# EAGLE design final (EAGLE 9.6.2)
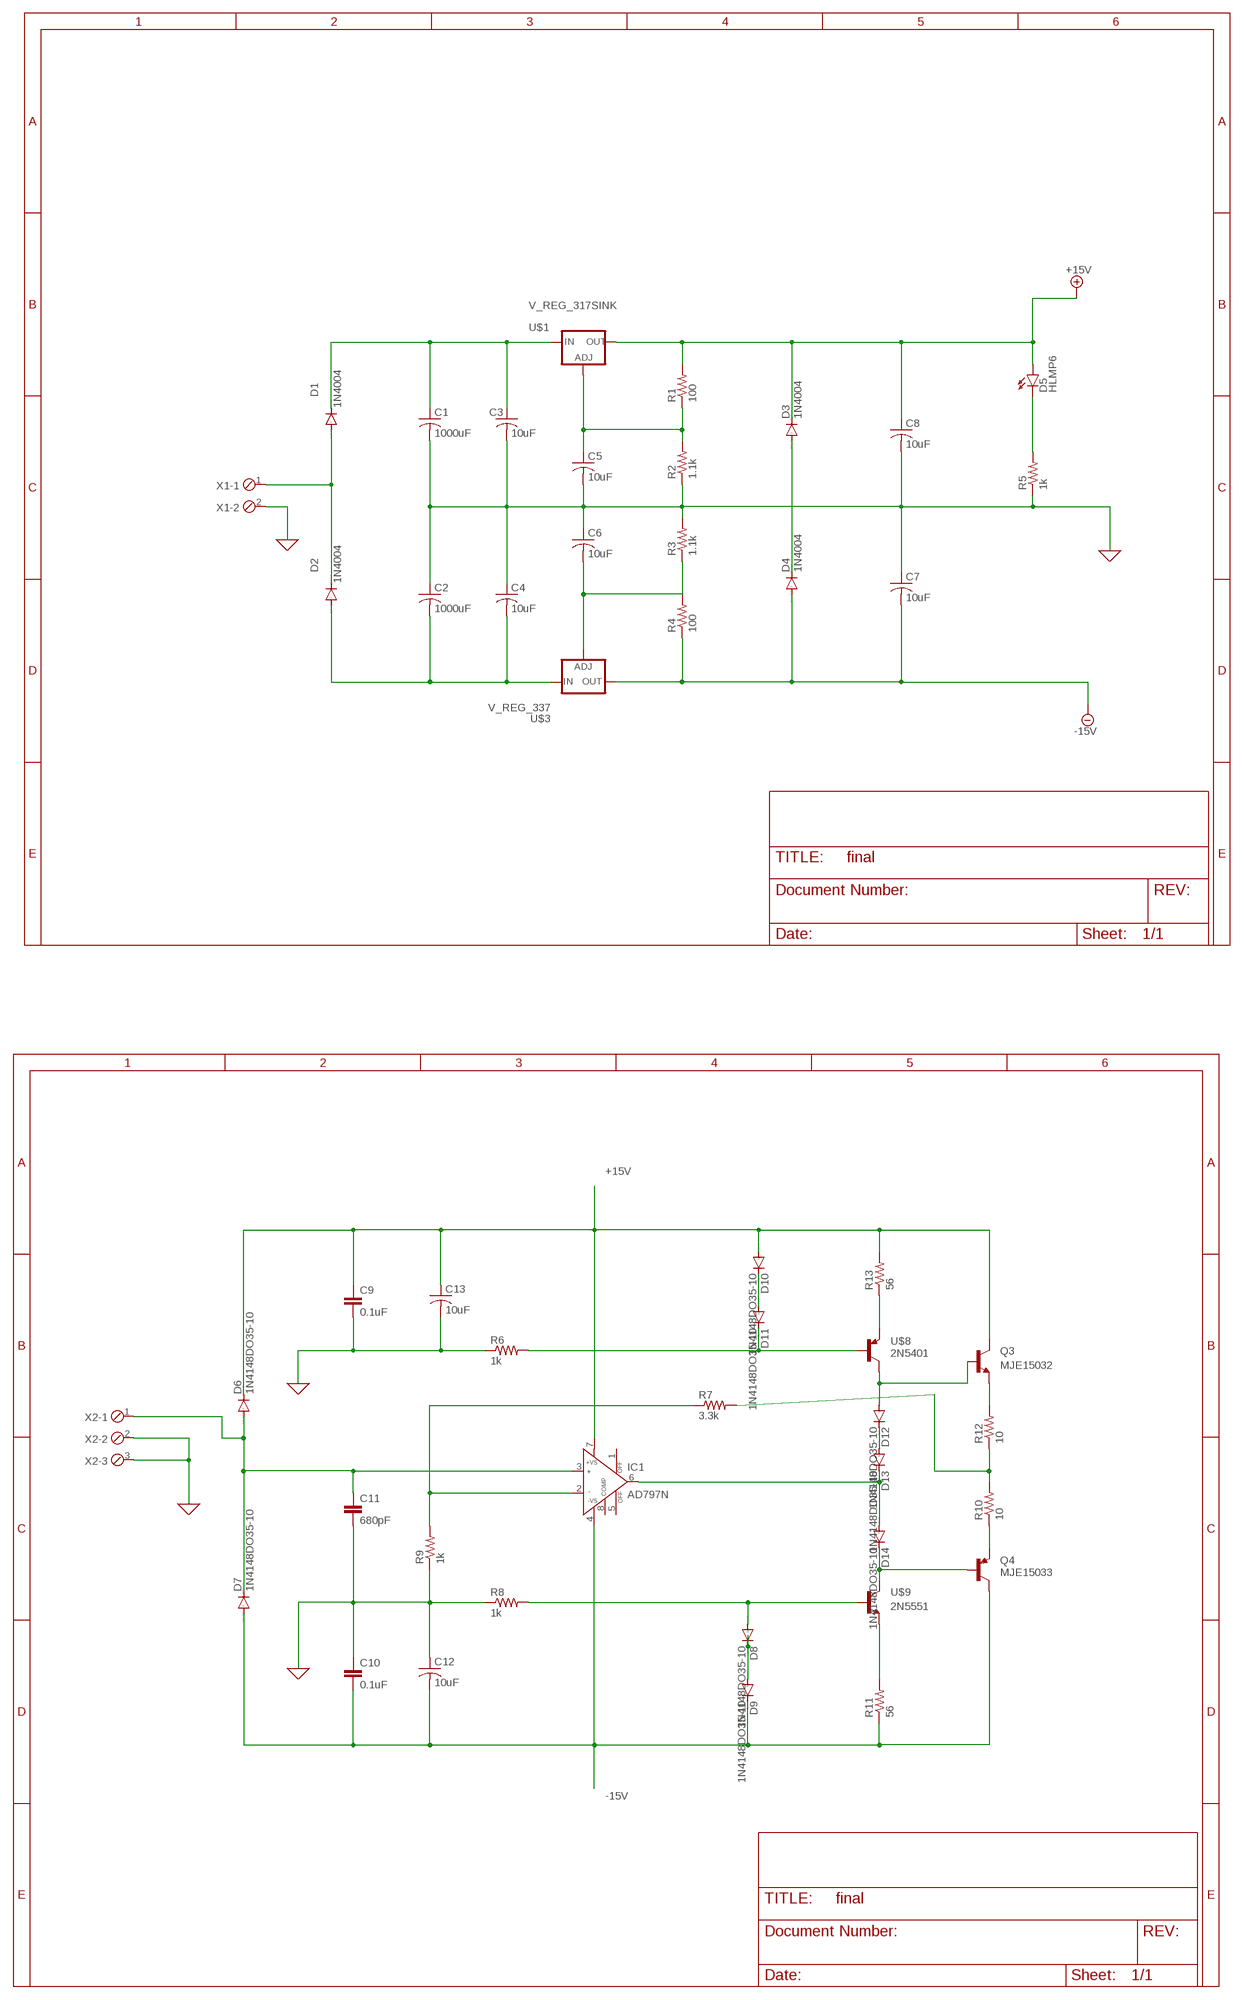
[diagram p0: schematic, sheet 1, part 1 of 2]
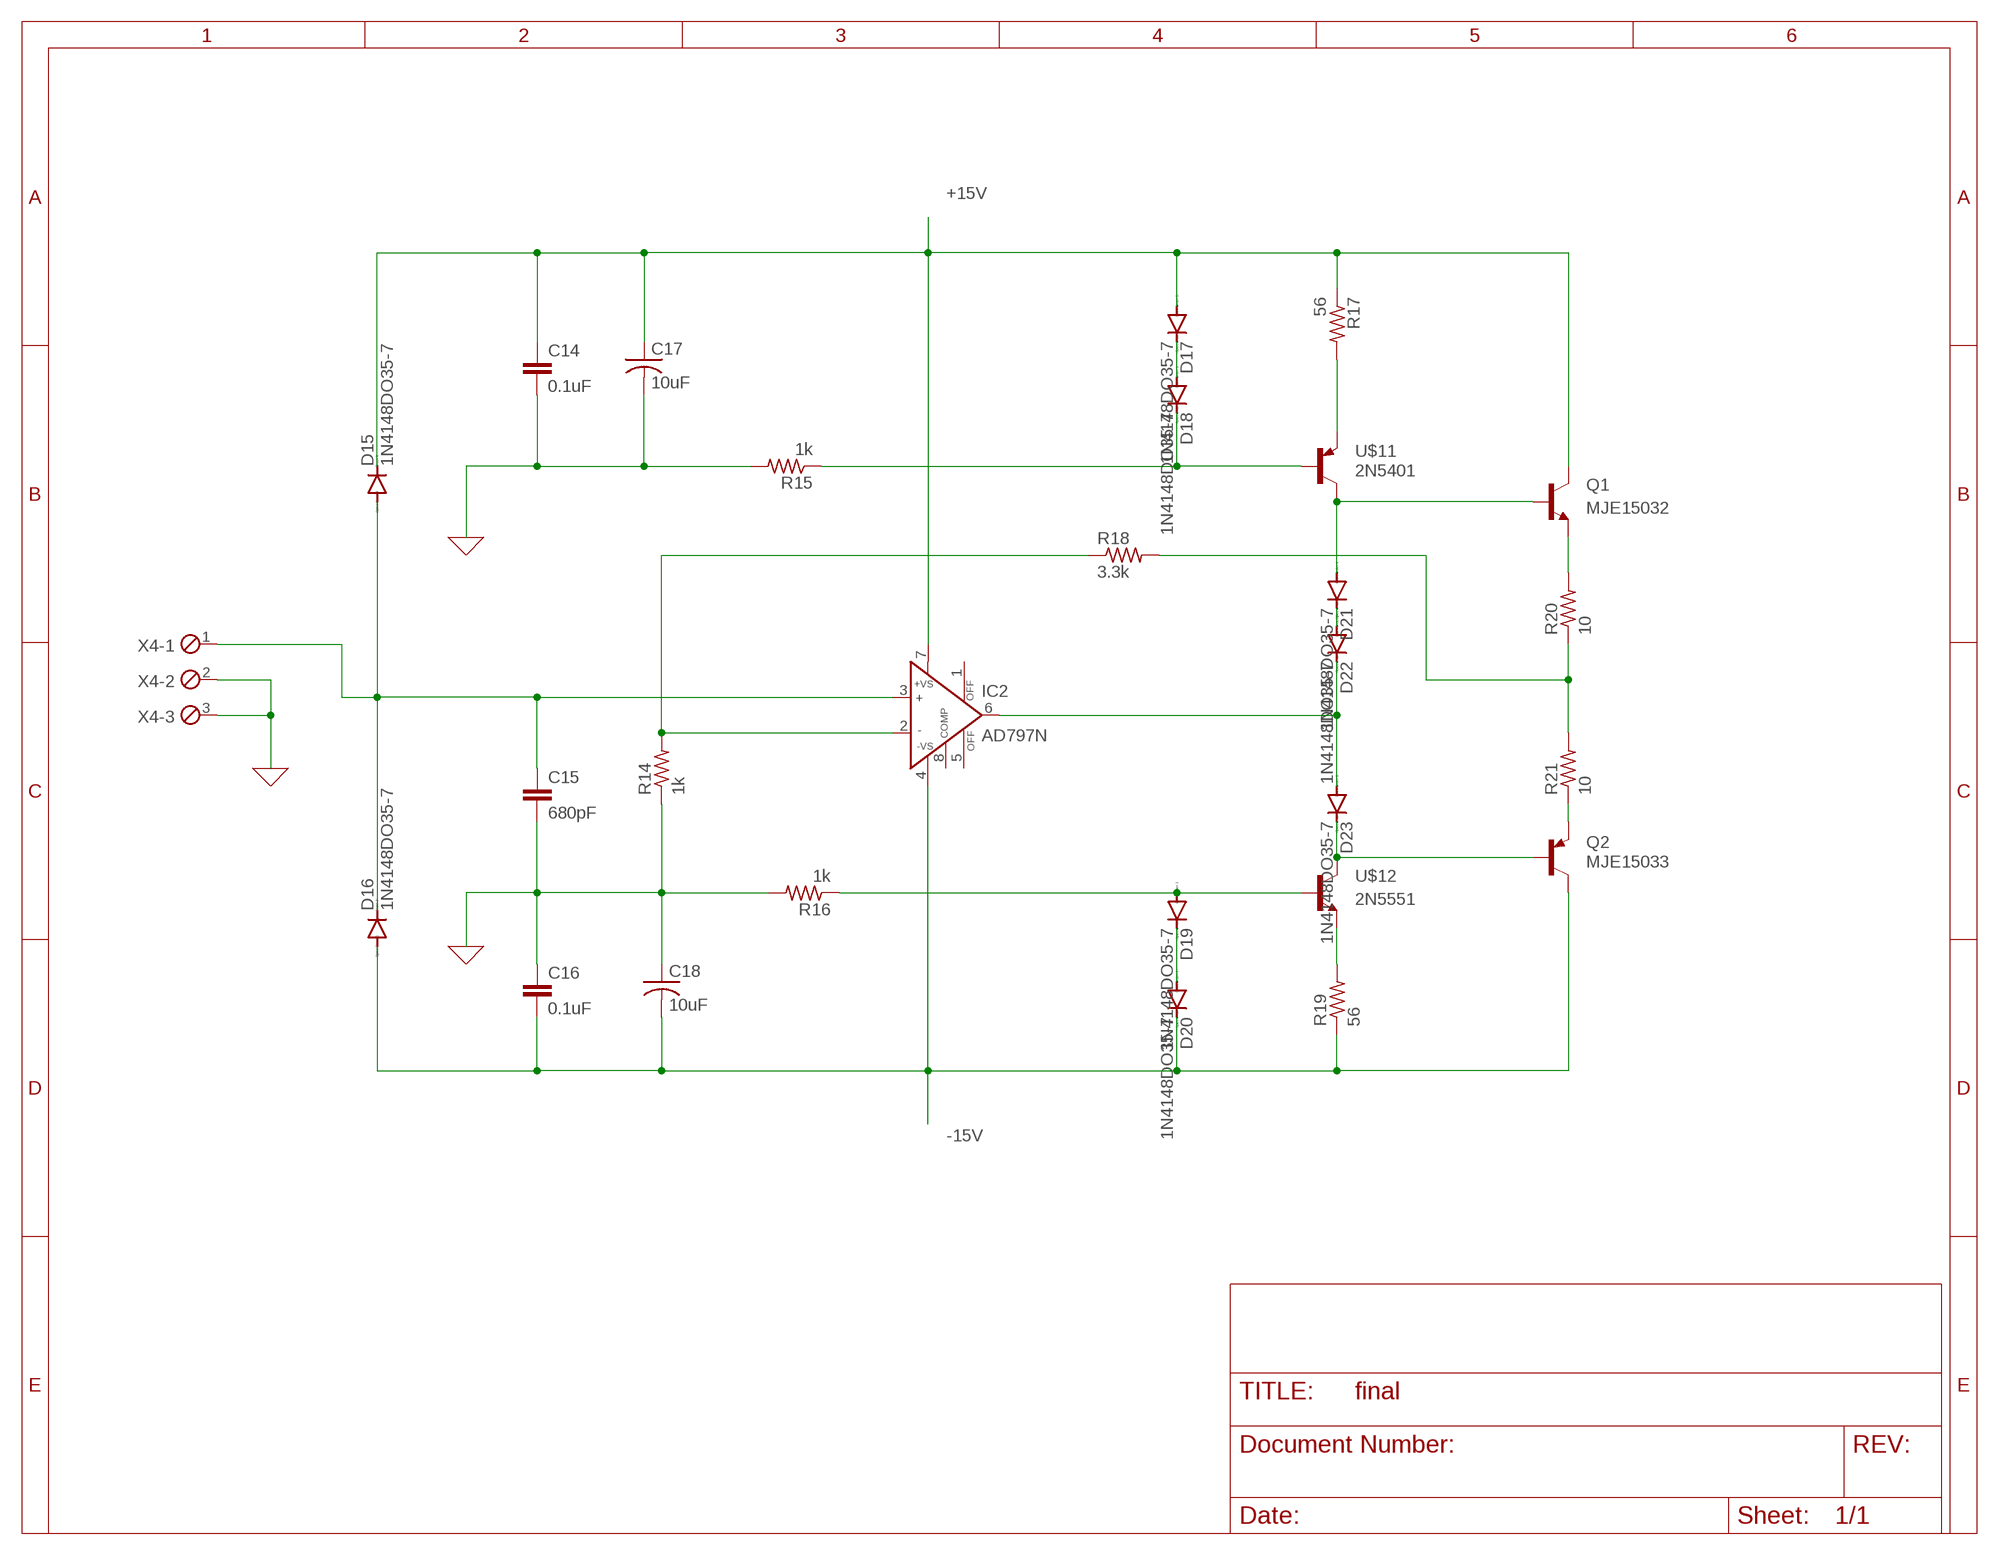
[diagram p1: schematic, sheet 1, part 2 of 2]

## Parts
C1  1000uF  C-US050-024X044  [C050-024X044]
C2  1000uF  C-US050-024X044  [C050-024X044]
C3  10uF  C-US050-024X044  [C050-024X044]
C4  10uF  C-US050-024X044  [C050-024X044]
C5  10uF  C-US050-024X044  [C050-024X044]
C6  10uF  C-US050-024X044  [C050-024X044]
C7  10uF  C-US050-024X044  [C050-024X044]
C8  10uF  C-US050-024X044  [C050-024X044]
C9  0.1uF  C2,5-3  [C2.5-3]
C10  0.1uF  C2,5-3  [C2.5-3]
C11  680pF  C2,5-3  [C2.5-3]
C12  10uF  C-US050-024X044  [C050-024X044]
C13  10uF  C-US050-024X044  [C050-024X044]
C14  0.1uF  C2,5-3  [C2.5-3]
C15  680pF  C2,5-3  [C2.5-3]
C16  0.1uF  C2,5-3  [C2.5-3]
C17  10uF  C-US050-024X044  [C050-024X044]
C18  10uF  C-US050-024X044  [C050-024X044]
D1  1N4004  [DO41-10]
D2  1N4004  [DO41-10]
D3  1N4004  [DO41-10]
D4  1N4004  [DO41-10]
D5  HLMP6  [HLMP6]
D6  1N4148DO35-10  [DO35-10]
D7  1N4148DO35-10  [DO35-10]
D8  1N4148DO35-10  [DO35-10]
D9  1N4148DO35-10  [DO35-10]
D10  1N4148DO35-10  [DO35-10]
D11  1N4148DO35-10  [DO35-10]
D12  1N4148DO35-10  [DO35-10]
D13  1N4148DO35-10  [DO35-10]
D14  1N4148DO35-10  [DO35-10]
D15  1N4148DO35-7  [DO35-7]
D16  1N4148DO35-7  [DO35-7]
D17  1N4148DO35-7  [DO35-7]
D18  1N4148DO35-7  [DO35-7]
D19  1N4148DO35-7  [DO35-7]
D20  1N4148DO35-7  [DO35-7]
D21  1N4148DO35-7  [DO35-7]
D22  1N4148DO35-7  [DO35-7]
D23  1N4148DO35-7  [DO35-7]
IC1  AD797N  [DIL08]
IC2  AD797N  [DIL08]
Q1  MJE15032  [TO220V]
Q2  MJE15033  [TO220V]
Q3  MJE15032  [TO220V]
Q4  MJE15033  [TO220V]
R1  100  R-US_0204/7  [0204/7]
R2  1.1k  R-US_0204/7  [0204/7]
R3  1.1k  R-US_0204/7  [0204/7]
R4  100  R-US_0204/7  [0204/7]
R5  1k  R-US_0204/7  [0204/7]
R6  1k  R-US_0204/7  [0204/7]
R7  3.3k  R-US_0204/7  [0204/7]
R8  1k  R-US_0204/7  [0204/7]
R9  1k  R-US_0204/7  [0204/7]
R10  10  R-US_0204/7  [0204/7]
R11  56  R-US_0204/7  [0204/7]
R12  10  R-US_0204/7  [0204/7]
R13  56  R-US_0204/7  [0204/7]
R14  1k  R-US_0204/7  [0204/7]
R15  1k  R-US_0204/7  [0204/7]
R16  1k  R-US_0204/7  [0204/7]
R17  56  R-US_0204/7  [0204/7]
R18  3.3k  R-US_0204/7  [0204/7]
R19  56  R-US_0204/7  [0204/7]
R20  10  R-US_0204/7  [0204/7]
R21  10  R-US_0204/7  [0204/7]
U$1  V_REG_317SINK  [TO220-ADJ]
U$3  V_REG_337  [TO220-ADJ-NEG]
U$8  2N5401  [2N5401]
U$9  2N5551  [2N5551]
U$11  2N5401  [2N5401]
U$12  2N5551  [2N5551]
X1  MPT2  [2POL254]
X2  MPT3  [3POL254]
X4  MPT3  [3POL254]

## Nets
0: C1.2 C2.1 C3.2 C4.1 C5.2 C6.1 C7.1 C8.2 C9.2 C10.1 C11.2 C12.1 C13.2 C14.2 C15.2 C16.1 C17.2 C18.1 R2.1 R3.2 R5.1 R6.1 R8.1 R9.1 R14.1 R15.2 R16.2 X1.2 X2.2 X2.3 X4.2 X4.3 ; supply symbol labelled GND
+15V: C8.1 C9.1 C13.1 C14.1 C17.1 D3.C D5.A D6.C D10.A D15.C D17.A IC1.7(+VS) IC2.7(+VS) Q1.2(C) Q3.2(C) R1.2 R13.2 R17.1 U$1.OUT
-15V: C7.2 C10.2 C12.2 C16.2 C18.2 D4.A D7.A D9.C D16.A D20.C IC1.4(-VS) IC2.4(-VS) Q2.2(C) Q4.2(C) R4.1 R11.1 R19.1 U$3.OUT
N$1: D1.A D2.C X1.1
N$2: C2.2 C4.2 D2.A U$3.IN
N$3: C1.1 C3.1 D1.C U$1.IN
N$4: C11.1 D6.A D7.C IC1.3(IN+) X2.1
N$6: D11.C R6.2 U$8.B
N$7: D10.C D11.A
N$8: R13.1 U$8.C(E)
N$9: D8.A R8.2 U$9.B
N$10: C5.1 R1.1 R2.2 U$1.ADJ
N$11: D8.C D9.A
N$12: C6.2 R3.1 R4.2 U$3.ADJ
N$14: D3.A D4.C
N$15: R11.2 U$9.E
N$16: D5.K R5.2
N$17: D12.A Q3.1(B) U$8.E(C)
N$18: D12.C D13.A
N$19: D13.C D14.A IC1.6(OUT)
N$20: D14.C Q4.1(B) U$9.C
N$21: IC1.2(IN-) R7.1 R9.2
N$22: Q3.3(E) R12.2
N$23: R7.2 R10.2 R12.1
N$24: Q4.3(E) R10.1
N$26: D18.C R15.1 U$11.B
N$27: D17.C D18.A
N$28: R17.2 U$11.C(E)
N$29: D21.A Q1.1(B) U$11.E(C)
N$31: D19.C D20.A
N$32: C15.1 D15.A D16.C IC2.3(IN+) X4.1
N$33: IC2.2(IN-) R14.2 R18.1
N$35: D19.A R16.1 U$12.B
N$36: R19.2 U$12.E
N$37: D23.C Q2.1(B) U$12.C
N$38: D22.C D23.A IC2.6(OUT)
N$39: D21.C D22.A
N$40: Q2.3(E) R21.1
N$41: R18.2 R20.1 R21.2
N$42: Q1.3(E) R20.2
Unconnected: IC1.1(OFF) IC1.5(OFF) IC1.8(COMP) IC2.1(OFF) IC2.5(OFF) IC2.8(COMP)

## Library data of the parts
C1-C8 C12 C13 C17 C18 = rcl:C-US: CAPACITOR, American symbol; SPICEPREFIX: C
C9-C11 C14-C16 = capacitor-wima:C: CAPACITOR naming: grid - package width
D1-D4 = diode:1N4004: DIODE general purpose rectifier, 1 A
D5 = display-hp:HLMP6: LED 2mm horizontal; MF: AGILENT TECHNOLOGIES; MPN: HLMP-6500; OC_FARNELL: 1652490; OC_NEWARK: 40K0088
D6-D23 = diode:1N4148: DIODE high speed (Philips)
IC1 IC2 = analog-devices:AD797: Ultralow Distortion, Ultralow Noise Op Amp Source: http://www.analog.com/static/imported-files/data_sheets/AD797.pdf; MF: ALTERA CORPORATION; MPN: AD797ANZ; OC_FARNELL: 9603778; OC_NEWARK: 59K6088
Q1 Q3 = engr301-proj :MJE15032: NPN Power Transistor HF Audio Driver 8.0A, 250V, 50W
Q2 Q4 = engr301-proj :MJE15033: PNP Power Transistor HF Audio Driver 8.0A, 250V, 50W
R1-R21 = rcl:R-US_: RESISTOR, American symbol; SPICEPREFIX: R
U$1 = engr301-proj :V_REG_317: Voltage Regulator Standard LM317 adjustable voltage regulator. AOI (Adjust Output Input). Google 'LM317 Calculator' for easy to use app to get the two resistor values needed. 240/720 for 5V output. 240/390 for 3.3V output. Spark Fun Electronics SKU : COM-00527
U$3 = engr301-proj :V_REG_337: LM-337 Negative Adjustable Voltage Regulator
U$8 U$11 = engr301-proj :2N5401
U$9 U$12 = engr301-proj :2N5551
X1 = con-phoenix-254:MPT2: PHOENIX CONNECTOR; OC_FARNELL: unknown; OC_NEWARK: unknown
X2 X4 = con-phoenix-254:MPT3: PHOENIX CONNECTOR; OC_FARNELL: unknown; OC_NEWARK: unknown

## Board
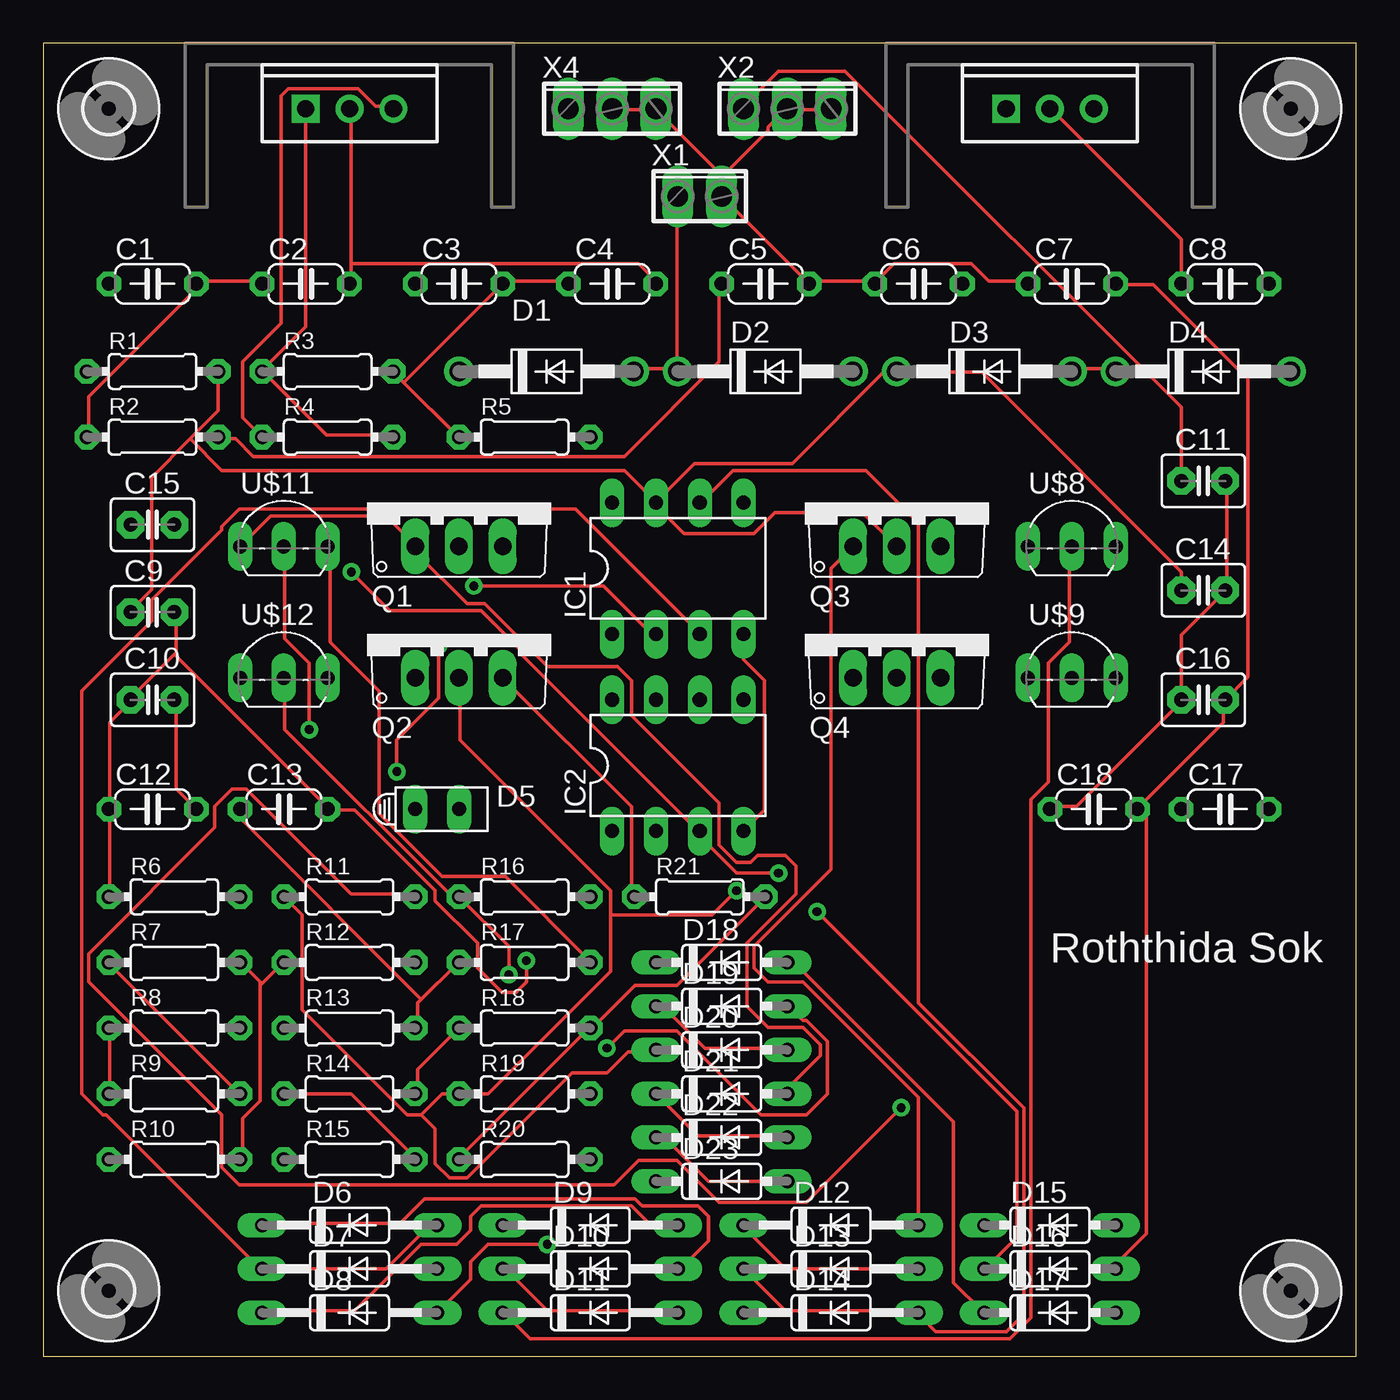
[diagram p2: board, top side]
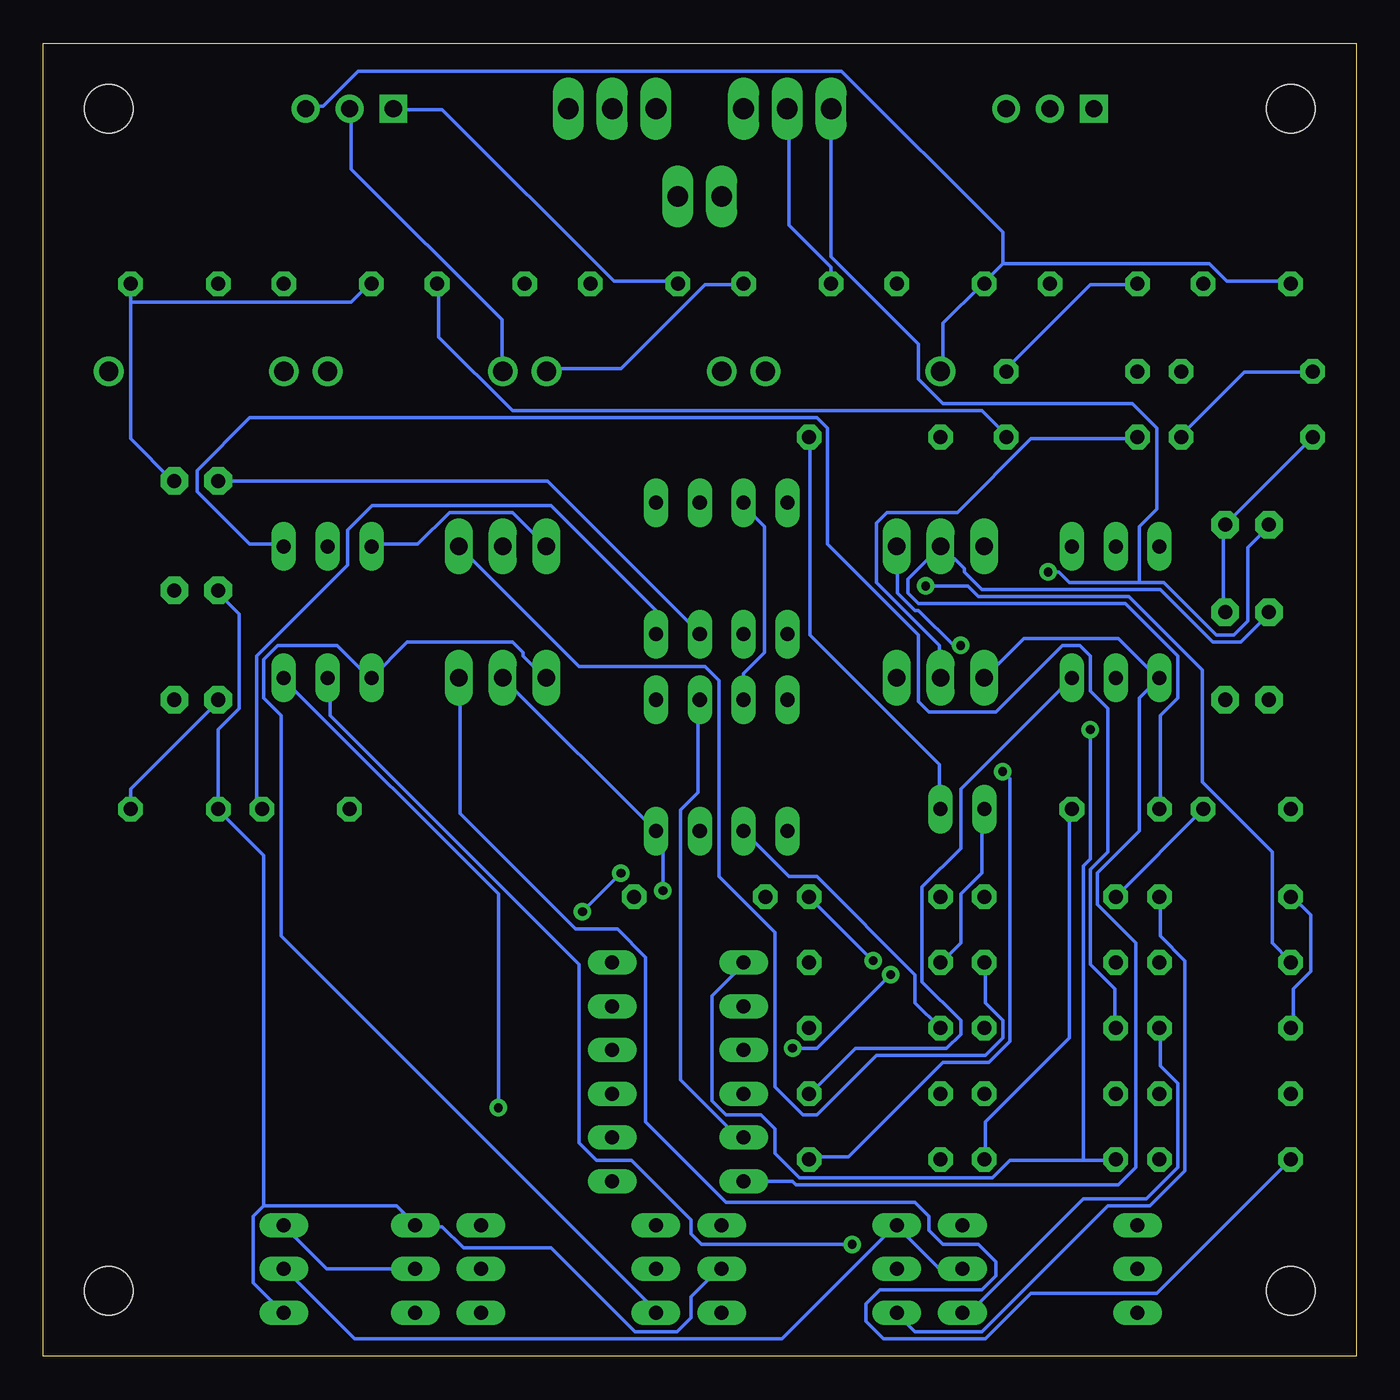
[diagram p3: board, bottom side, seen from below]

Size 76.2 x 76.2 mm. Coordinates in mm from the lower left corner, seen from the top.
Outline: 0,0 76.2,0 76.2,76.2 0,76.2 0,0
Copper layers (1*16): Top 0.035mm / dielectric 1.5mm / Bottom 0.035mm
Design rules "engr301_drc_Mojan_change_25 (1)": minimum track width 8mil, minimum drill 20mil, track to track 8mil, track to pad 10mil, pad to pad 10mil, via to via 10mil, smd to smd 8mil, copper to edge 25mil, drill to drill 8mil, minimum pad ring 12mil, minimum via ring 10mil, stop-mask expansion 4mil, vias tented up to drill 25mil, thermal gap 10mil

### Footprints (pad centres in the part's own frame; a part is rotated, then mirrored left to right if it is on the bottom)
C050-024X044 = drill 0.813 octagon: 1 -2.54,0; 2 2.54,0
C2.5-3 = drill 0.813 pad 1.6 octagon: 1 -1.27,0; 2 1.27,0
DO41-10 = drill 1.118: A 5.08,0; C -5.08,0
HLMP6 = drill 0.813 long: A -1.27,0; K 1.27,0
DO35-10 = drill 0.813 long: A 5.08,0; C -5.08,0
DO35-7 = drill 0.813 long: A 3.81,0; C -3.81,0
DIL08 = drill 0.813 long: 1 -3.81,-3.81; 2 -1.27,-3.81; 3 1.27,-3.81; 4 3.81,-3.81; 5 3.81,3.81; 6 1.27,3.81; 7 -1.27,3.81; 8 -3.81,3.81
TO220V = drill 1.016 long: 1 -2.54,-2.54; 2 0,-2.54; 3 2.54,-2.54
0204/7 = drill 0.813 octagon: 1 -3.81,0; 2 3.81,0
TO220-ADJ = drill 1 square: ADJ -2.54,0 | drill 1: IN 2.54,0; OUT 0,0
2,8 = hole 2.8: 0,0
TO220-ADJ-NEG = drill 1 square: ADJ -2.54,0 | drill 1: IN 0,0; OUT 2.54,0
2N5401 = drill 0.813 long: B 0,0; C 2.54,0; E -2.54,0
2N5551 = drill 0.813 long: B 0,0; C -2.54,0; E 2.54,0
2POL254 = drill 1.2 long: 1 -1.27,0; 2 1.27,0
3POL254 = drill 1.2 long: 1 -2.54,0; 2 0,0; 3 2.54,0

### Placement (x,y rotation side)
C1  6.35,62.23 0 top
C2  15.24,62.23 0 top
C3  24.13,62.23 0 top
C4  33.02,62.23 0 top
C5  41.91,62.23 0 top
C6  50.8,62.23 0 top
C7  59.69,62.23 0 top
C8  68.58,62.23 0 top
C9  6.35,43.18 0 top
C10  6.35,38.1 0 top
C11  67.31,50.8 0 top
C12  6.35,31.75 0 top
C13  13.97,31.75 0 top
C14  67.31,44.45 0 top
C15  6.35,48.26 0 top
C16  67.31,38.1 0 top
C17  68.58,31.75 0 top
C18  60.96,31.75 0 top
D1  29.21,57.15 0 top
D2  41.91,57.15 0 top
D3  54.61,57.15 0 top
D4  67.31,57.15 0 top
D5  22.86,31.75 0 top
D6  17.78,7.62 0 top
D7  17.78,5.08 0 top
D8  17.78,2.54 0 top
D9  31.75,7.62 0 top
D10  31.75,5.08 0 top
D11  31.75,2.54 0 top
D12  45.72,7.62 0 top
D13  45.72,5.08 0 top
D14  45.72,2.54 0 top
D15  58.42,7.62 0 top
D16  58.42,5.08 0 top
D17  58.42,2.54 0 top
D18  39.37,22.86 0 top
D19  39.37,20.32 0 top
D20  39.37,17.78 0 top
D21  39.37,15.24 0 top
D22  39.37,12.7 0 top
D23  39.37,10.16 0 top
IC1  36.83,45.72 0 top
IC2  36.83,34.29 0 top
Q1  24.13,49.53 0 top
Q2  24.13,41.91 0 top
Q3  49.53,49.53 0 top
Q4  49.53,41.91 0 top
R1  6.35,57.15 0 top
R2  6.35,53.34 0 top
R3  16.51,57.15 0 top
R4  16.51,53.34 0 top
R5  27.94,53.34 0 top
R6  7.62,26.67 0 top
R7  7.62,22.86 0 top
R8  7.62,19.05 0 top
R9  7.62,15.24 0 top
R10  7.62,11.43 0 top
R11  17.78,26.67 0 top
R12  17.78,22.86 0 top
R13  17.78,19.05 0 top
R14  17.78,15.24 0 top
R15  17.78,11.43 0 top
R16  27.94,26.67 0 top
R17  27.94,22.86 0 top
R18  27.94,19.05 0 top
R19  27.94,15.24 0 top
R20  27.94,11.43 0 top
R21  38.1,26.67 0 top
U$1  58.42,72.39 0 top
U$2  [2,8]  3.81,72.39 0 top
U$3  17.78,72.39 0 top
U$4  [2,8]  72.39,72.39 0 top
U$5  [2,8]  72.39,3.81 0 top
U$6  [2,8]  3.81,3.81 0 top
U$8  59.69,46.99 0 top
U$9  59.69,39.37 0 top
U$11  13.97,46.99 0 top
U$12  13.97,39.37 0 top
X1  38.1,67.31 0 top
X2  43.18,72.39 0 top
X4  33.02,72.39 0 top

### Tracks (layer width: path | path; a pad name or v marks a point on that pad's centre or on a via)
0  (via drill 0.51)
  Top 0.203: R9.1 3.86,15.24 3.86,18.9 R8.1 | R6.1 3.86,26.82 3.86,31.7 C12.1 3.86,31.9 3.86,36.78 5.08,38 C10.1 5.08,38.2 7.72,40.84 | R14.1 17.88,15.24 21.54,11.58 R15.2 | 7.72,40.84 7.72,43.08 C9.2 | 7.72,40.84 7.72,40.64 16.46,31.9 C13.2 16.66,31.7 18.09,31.7 22.76,27.03 22.76,26.42 25.2,23.98 25.2,22.55 26.62,21.13 27.43,21.13 28.04,21.74 v28.04,22.96 | C18.1 58.52,31.9 59.94,31.9 66.04,38 C16.1 66.04,41.86 68.48,44.3 C14.2 68.68,44.5 68.68,50.8 C11.2 | C4.1 30.48,62.38 26.82,62.38 C3.2 20.93,56.49 | C2.1 12.6,62.38 8.94,62.38 C1.2 8.74,62.18 8.74,61.77 2.64,55.68 2.64,53.44 R2.1 | 20.93,56.49 23.98,53.44 R5.1 | 20.93,56.49 20.32,57.1 R3.2 | C7.1 57.1,62.38 54.86,62.38 53.85,63.4 49.38,63.4 48.36,62.38 C6.1 48.16,62.38 44.5,62.38 C5.2 X1.2 | X2.3 45.72,72.34 43.28,72.34 X2.2 43.08,72.34 42.06,71.32 42.06,71.12 39.22,68.28 | 35.56,72.34 33.12,72.34 X4.2 | 39.22,68.28 39.22,68.68 35.56,72.34 | 39.22,68.28 39.22,67.46 X1.2 | 35.56,72.34 X4.3 | 39.22,68.28 X1.2
  Bottom 0.203: R8.1 3.66,19.1 3.66,21.34 2.64,22.35 2.64,25.6 3.66,26.62 R6.1 | R2.1 C15.2 7.72,48.16 7.72,43.28 C9.2 | v28.04,22.96 R16.2 | R15.2 21.54,11.58 21.54,13.61 16.66,18.49 16.66,31.7 C13.2 | C17.2 71.12,32.92 66.04,38 C16.1 | 71.12,61.16 71.12,53.24 68.68,50.8 C11.2 | 71.12,61.16 C8.2 | C2.1 12.8,62.18 15.44,62.18 20.32,57.3 R3.2 | C4.1 30.48,63.2 32.92,65.63 32.92,72.34 X4.2 | 71.12,61.16 58.32,61.16 57.3,62.18 C7.1
+15V
  Top 0.203: 21.95,20.73 23.98,22.76 R17.1 | 21.95,20.73 21.74,20.52 21.74,19.1 R13.2 | 21.95,20.73 11.58,31.09 11.58,31.7 C13.1 | R1.2 10.16,54.86 8.53,53.24 | 8.53,53.24 6.3,51 6.3,44.5 5.08,43.28 C9.1 | D6.C 12.8,7.72 20.73,7.72 22.15,9.14 34.34,9.14 34.75,8.74 38,8.74 38.61,8.13 38.61,6.71 36.98,5.08 D10.A | C8.1 66.04,64.82 58.52,72.34 U$1.OUT | Q3.2 47.55,48.97 42.47,48.97 41.25,47.75 37.19,47.75 35.56,49.38 IC1.7 35.56,49.58 | 35.56,49.58 37.8,51.82 43.48,51.82 48.77,57.1 49.38,57.1 D3.C 49.58,57.1 54.46,57.1 66.04,45.52 C14.1 | 8.53,53.24 10.36,51.41 33.73,51.41 35.56,49.58
  Bottom 0.203: D5.A 21.74,31.7 21.74,28.04 22.96,26.82 22.96,23.98 23.98,22.96 R17.1 | C9.1 5.08,43.08 6.71,41.45 8.33,41.45 11.38,44.5 21.74,44.5 22.76,45.52 22.76,45.72 23.98,46.94 Q1.2 26.01,45.11 26.01,44.3 25.4,43.69 13.41,43.69 10.36,40.64 10.36,38.2 11.38,37.19 11.38,31.9 C13.1 | 63.4,8.74 64.01,8.13 64.01,4.27 62.38,2.64 D17.A | 63.4,8.74 55.68,8.74 54.66,7.72 D15.C 54.46,7.52 53.03,7.52 51.82,6.3 46.74,6.3 41.86,1.42 39.42,1.42 38.61,2.23 38.61,3.45 36.98,5.08 D10.A | C14.1 66.04,44.3 64.82,43.08 64.82,37.59 66.04,36.37 C17.1 66.04,31.7 63.4,29.06 63.4,8.74 | IC2.7 35.56,39.62 34.34,40.84 34.34,48.16 35.56,49.38 IC1.7 | U$1.OUT 58.32,72.34 58.32,68.89 49.58,60.15 49.58,57.3 D3.C
-15V  (via drill 0.51)
  Top 0.203: R4.1 11.58,54.46 11.58,57.71 13.82,59.94 13.82,73.15 14.22,73.56 18.29,73.56 19.3,72.54 20.32,72.54 U$3.OUT | 21.95,14.02 23.16,15.24 R19.1 25.81,15.24 32.92,22.35 32.92,25.6 | 21.95,14.02 21.13,14.02 15.04,20.12 15.04,25.6 R11.1 | 21.95,14.02 22.76,13.21 22.76,11.18 23.57,10.36 24.59,10.36 30.68,16.46 32.72,16.46 33.93,17.68 35.56,17.68 D20.C | C12.2 7.72,32.92 7.72,38 C10.2 | 32.92,25.6 32.92,27.03 24.18,35.76 24.18,39.22 Q2.2 | IC1.4 40.64,40.44 41.86,39.22 41.86,31.7 IC2.4 | 69.9,57.3 72.34,57.3 D4.A | 69.9,57.3 69.29,57.3 64.41,62.18 62.38,62.18 C7.2 | D16.A 62.38,5.08 62.38,5.49 64.01,7.11 64.01,31.29 63.6,31.7 C18.2 63.6,31.9 68.48,36.78 68.48,38 C16.2 69.9,39.42 69.9,57.3 | 32.92,25.6 38.81,25.6 v40.23,27.03
  Bottom 0.203: R4.1 12.8,53.24 18.9,53.24 23.16,48.97 27.23,48.97 27.84,48.36 27.84,44.91 24.18,41.25 24.18,39.42 Q2.2 | C12.2 R11.1 | Q4.2 IC2.4 40.23,30.07 v40.23,27.03 | D7.A 24.18,5.08 26.62,7.52 D9.C 26.82,7.52 33.33,1.02 58.12,1.02 62.18,5.08 D16.A | IC1.4 40.64,43.28 46.74,49.38 57.1,49.38 58.52,47.95 58.52,45.92 63.8,40.64 63.8,32.11 63.6,31.9 C18.2
N$1
  Top 0.203: 36.78,57.3 34.34,57.3 D1.A | 36.78,57.3 36.78,67.26 X1.1 | 36.78,57.3 D2.C
N$2
  Top 0.203: 17.88,63.4 17.88,72.34 U$3.IN | 17.88,63.4 17.88,62.38 C2.2 | 17.88,63.4 34.54,63.4 35.56,62.38 C4.2
  Bottom 0.203: C4.2 35.56,62.18 37.8,62.18 42.67,57.3 46.94,57.3 D2.A
N$3
  Bottom 0.203: 20.52,63.4 8.53,63.4 7.52,62.38 3.86,62.38 C1.1 | 20.52,63.4 21.54,62.38 C3.1 21.74,62.18 23.98,59.94 23.98,57.3 D1.C | 20.52,63.4 20.52,65.23 29.87,74.57 57.91,74.57 59.94,72.54 60.96,72.54 U$1.IN
N$4
  Top 0.203: D6.A 22.76,7.52 22.35,7.52 19.91,5.08 D7.C 12.6,5.08 3.66,14.02 3.45,14.02 2.23,15.24 2.23,38.61 6.3,42.67 6.3,43.89 10.36,47.95 10.36,48.16 11.38,49.17 30.89,49.17 38,42.06 IC1.3 | C11.1 66.04,55.07 46.53,74.57 42.67,74.57 40.64,72.54 X2.1
  Bottom 0.203: C11.1 46.94,50.8 38.2,42.06 IC1.3
N$6
  Top 0.203: U$8.B 59.54,46.94 59.54,41.45 58.32,40.23 58.32,33.33 57.3,32.31 57.3,2.23 56.08,1.02 28.25,1.02 26.82,2.44 D11.C
  Bottom 0.203: R6.2 11.38,26.62 11.38,24.38 9.96,22.96 9.96,10.77 11.99,8.74 14.43,8.74 21.74,1.42 25.6,1.42 26.62,2.44 D11.C
N$7
  Top 0.203: D11.A 36.78,2.64 29.26,2.64 26.82,5.08 D10.C
N$8
  Bottom 0.203: R13.1 14.02,19.1 14.02,21.34 15.44,22.76 15.44,28.25 14.43,29.26 14.43,37.59 15.44,38.61 15.44,40.64 16.05,41.25 17.07,41.25 20.93,37.39 24.79,37.39 25.4,38 25.4,41.86 30.68,47.14 30.68,53.85 31.29,54.46 64.21,54.46 67.26,51.41 67.26,50.19 64.21,47.14 62.38,47.14 U$8.C
N$9  (via drill 0.51)
  Top 0.203: v29.26,6.5 25.81,6.5 24.79,5.49 24.79,4.47 D8.A
  Bottom 0.203: R8.2 11.38,18.9 11.38,16.87 10.36,15.85 10.36,10.97 12.19,9.14 15.85,9.14 22.35,2.64 22.76,2.64 D8.A | v29.26,6.5 38,6.5 38.61,7.11 38.61,7.92 42.06,11.38 44.09,11.38 45.11,12.39 45.11,22.76 59.54,37.19 59.54,39.22 U$9.B
N$10
  Top 0.203: R2.2 10.16,53.24 11.18,53.24 12.19,52.22 33.73,52.22 39.22,57.71 39.22,62.18 C5.1
  Bottom 0.203: R1.1 2.64,57.1 6.5,57.1 10.16,53.44 R2.2 | C5.1 39.42,62.38 43.08,62.38 53.03,72.34 55.88,72.34 U$1.ADJ
N$11
  Top 0.203: D8.C 12.8,2.64 18.09,2.64 21.95,6.5 23.98,6.5 24.79,7.32 24.79,8.13 25.4,8.74 34.14,8.74 35.15,7.72 36.78,7.72 D9.A
N$12
  Top 0.203: R4.2 20.32,53.44 16.46,53.44 12.8,57.1 R3.1 12.8,57.3 15.24,59.74 U$3.ADJ
  Bottom 0.203: C6.2 53.24,62.18 53.24,59.13 48.97,54.86 21.74,54.86 20.32,53.44 R4.2
N$14
  Top 0.203: D3.A 59.74,57.3 62.18,57.3 D4.C
N$15  (via drill 0.51)
  Top 0.203: v49.78,14.43 44.3,8.94 39.22,8.94 36.78,11.38 34.54,11.38 33.12,9.96 11.38,9.96 10.36,10.97 10.36,14.02 2.64,21.74 2.64,23.37 9.96,30.68 9.96,31.9 10.97,32.92 11.79,32.92 17.88,26.82 21.54,26.82 R11.2
  Bottom 0.203: v49.78,14.43 49.78,26.82 62.18,39.22 U$9.E
N$16
  Bottom 0.203: D5.K 24.18,31.9 24.18,34.34 31.7,41.86 31.7,53.24 R5.2
N$17
  Top 0.203: D12.A 50.8,15.04 44.09,21.74 42.06,21.74 41.25,22.55 41.25,23.77 45.72,28.25 45.72,45.72 Q3.1
  Bottom 0.203: Q3.1 48.97,48.97 52.63,48.97 54.46,47.14 57.1,47.14 U$8.E
N$18
  Top 0.203: D13.A 43.08,5.08 40.64,7.52 D12.C
N$19
  Top 0.203: D13.C 43.08,2.64 50.8,2.64 D14.A 50.8,2.44 51.82,1.42 55.88,1.42 56.9,2.44 56.9,14.43 50.8,20.52 50.8,48.36 47.75,51.41 40.03,51.41 38.2,49.58 IC1.6
N$20
  Bottom 0.203: D14.C 40.64,2.64 62.38,24.38 62.38,37.19 63.4,38.2 63.4,40.44 62.59,41.25 59.13,41.25 57.3,39.42 U$9.C 55.07,41.45 48.97,41.45 48.36,40.84 48.36,40.64 47.14,39.42 Q4.1
N$21  (via drill 0.51)
  Top 0.203: R9.2 11.38,15.24 3.86,22.76 R7.1 | v24.99,44.7 32.51,44.7 35.15,42.06 35.56,42.06 IC1.2
  Bottom 0.203: v24.99,44.7 22.55,44.7 21.95,44.09 13.21,44.09 8.94,39.83 8.94,33.33 4.88,29.26 4.88,23.98 3.86,22.96 R7.1
N$22
  Bottom 0.203: Q3.3 45.11,40.03 37.8,40.03 36.98,39.22 36.98,27.84 33.73,24.59 33.73,15.65 32.11,14.02 31.29,14.02 27.84,17.48 21.54,17.48 20.52,18.49 20.52,19.51 21.54,20.52 21.54,22.76 R12.2
N$23
  Top 0.203: 12.6,21.54 12.6,21.74 11.58,22.76 R7.2 | 12.6,21.54 12.6,14.83 11.58,13.82 11.58,11.58 R10.2 | 12.6,21.54 13.82,22.76 R12.1
N$24
  Bottom 0.203: R10.1 11.58,3.66 18.9,3.66 21.54,1.02 27.43,1.02 28.45,2.03 28.45,3.05 27.64,3.86 21.74,3.86 20.93,4.67 20.93,5.49 21.95,6.5 23.98,6.5 24.79,7.32 24.79,8.13 25.6,8.94 36.58,8.94 41.25,13.61 41.25,23.16 42.88,24.79 45.31,24.79 52.02,31.5 52.02,39.22 Q4.3
N$26  (via drill 0.51)
  Top 0.203: v15.44,36.37 15.44,40.23 14.02,41.66 14.02,46.94 U$11.B
  Bottom 0.203: 15.85,11.38 20.12,11.38 21.13,10.36 32.31,10.36 33.73,11.79 33.73,13.21 34.54,14.02 36.58,14.02 37.39,14.83 37.39,20.93 35.56,22.76 D18.C | 15.85,11.38 14.02,11.38 R15.1 | v15.44,36.37 15.44,28.85 15.85,28.45 15.85,11.38
N$27
  Top 0.203: D18.A 43.28,22.76 43.69,22.76 52.83,13.61 52.83,4.27 54.46,2.64 D17.C
N$28
  Top 0.203: U$11.C 16.66,46.94 16.66,41.45 19.51,38.61 19.51,31.5 23.16,27.84 26.82,27.84 31.7,22.96 R17.2
N$29
  Top 0.203: D21.A 43.28,15.24 43.28,15.65 45.11,17.48 45.11,18.09 44.09,19.1 42.06,19.1 40.84,20.32 40.84,23.98 43.69,26.82 43.69,28.45 43.08,29.06 41.45,29.06 41.05,28.65 40.23,28.65 39.22,29.67 39.22,32.11 34.14,37.19 34.14,39.22 33.33,40.03 29.26,40.03 25.6,43.69 24.59,43.69 21.74,46.53 21.74,46.94 Q1.1 21.54,47.14 19.91,48.77 13.21,48.77 U$11.E
N$31
  Top 0.203: D19.C 35.97,20.32 38.41,17.88 43.08,17.88 D20.A
N$32  (via drill 0.51)
  Top 0.203: v17.88,45.52 20.12,43.28 25.4,43.28 27.84,40.84 27.84,40.64 38,30.48 IC2.3 38.2,30.48 38.2,30.07 40.23,28.04 v42.67,28.04 | v44.91,25.81 56.49,14.22 56.49,6.91 54.66,5.08 D16.C
  Bottom 0.203: D16.C 59.74,5.08 62.18,7.52 D15.A | v17.88,45.52 17.27,45.52 16.66,44.91 12.6,44.91 | 12.6,44.91 11.18,44.91 8.13,41.86 7.11,41.86 6.3,42.67 6.3,46.94 5.08,48.16 C15.1 | X4.1 30.48,63.8 25.4,58.73 25.4,56.69 23.98,55.27 13.01,55.27 11.58,53.85 11.58,49.17 12.6,48.16 12.6,44.91 | v42.67,28.04 v44.91,25.81
N$33
  Top 0.203: R18.1 21.74,16.66 21.74,15.24 R14.2
  Bottom 0.203: IC2.2 32.92,27.84 31.29,27.84 25.6,22.15 25.6,20.52 R18.1
N$35  (via drill 0.51)
  Top 0.203: U$12.B 14.02,39.22 14.02,36.37 23.57,26.82 23.98,26.82 R16.1 27.03,23.77 v27.03,22.15 | v32.72,17.88 33.73,18.9 36.78,18.9 41.66,14.02 44.3,14.02 45.52,15.24 45.52,18.29 44.3,19.51 44.09,19.51 43.28,20.32 D19.A
  Bottom 0.203: v32.72,17.88 31.29,17.88 v27.03,22.15
N$36
  Bottom 0.203: U$12.E 22.96,32.92 22.96,29.46 25.2,27.23 25.2,21.74 22.96,19.51 22.96,18.69 23.77,17.88 29.06,17.88 31.7,15.24 R19.2
N$37
  Bottom 0.203: Q2.1 19.3,41.66 13.82,41.66 11.58,39.42 U$12.C 12.6,38.2 12.6,30.48 15.04,28.04 15.04,26.21 12.8,23.98 12.8,10.97 13.82,9.96 32.51,9.96 32.72,10.16 D23.C
N$38
  Top 0.203: D23.A 38.61,10.16 36.17,12.6 35.56,12.6 D22.C
  Bottom 0.203: IC2.6 38.2,38 38.2,32.72 39.22,31.7 39.22,16.05 35.97,12.8 35.56,12.8 D22.C
N$39
  Top 0.203: D21.C 38,12.8 43.08,12.8 D22.A
N$40
  Top 0.203: Q2.3 34.14,31.9 34.14,26.82 R21.1
N$41
  Top 0.203: R20.1 24.18,11.58 31.7,19.1 R18.2 31.9,19.1 34.34,21.54 36.78,21.54 R21.2
N$42  (via drill 0.51)
  Top 0.203: v20.52,33.93 20.52,35.76 22.96,38.2 v22.96,41.25
  Bottom 0.203: v20.52,33.93 20.12,33.53 20.12,18.29 21.34,17.07 23.98,17.07 29.46,11.58 31.7,11.58 R20.2 | v22.96,41.25 23.37,41.25 25.4,43.28 25.6,43.28 26.62,44.3 26.62,46.94 Q1.3

### Text on the board
tNames: Roththida Sok